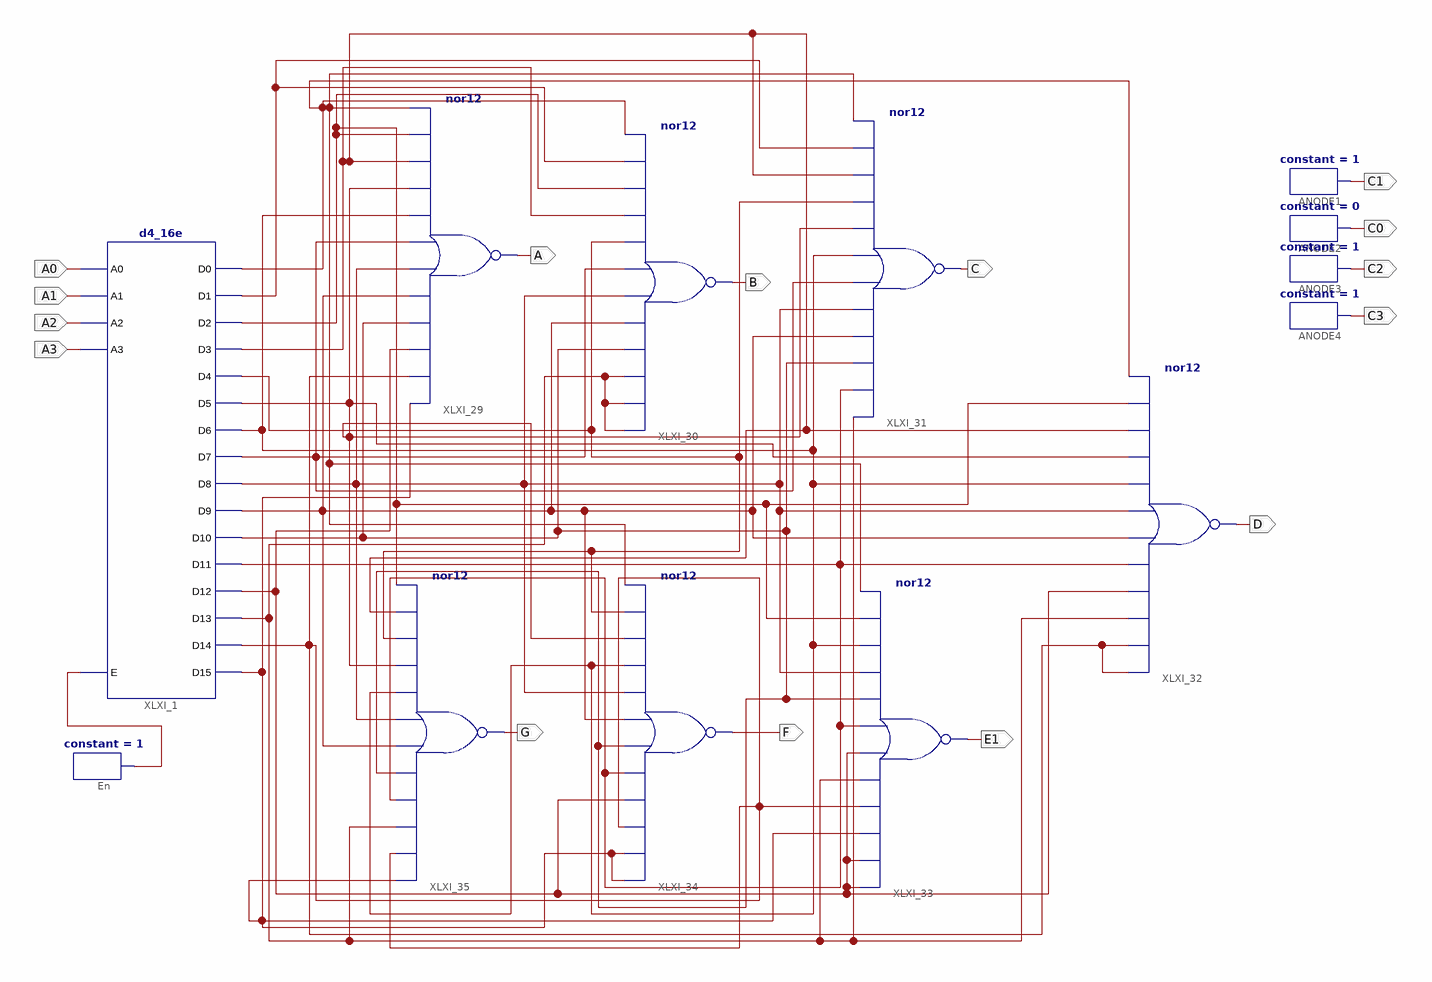
[diagram p0: schematic sheet 1]
// Xilinx ISE schematic Ass3.sch (spartan6) as structural Verilog: 13 symbols, 15 ports
module Ass3 (
  input  A0,
  input  A1,
  input  A2,
  input  A3,
  output D,
  output E1,
  output A,
  output B,
  output C,
  output F,
  output G,
  output C0,
  output C2,
  output C3,
  output C1
);

  wire XLXN_24, XLXN_26, XLXN_27, XLXN_29, XLXN_32, XLXN_33, XLXN_39, XLXN_40, XLXN_41, XLXN_46, XLXN_52,
       XLXN_56, XLXN_59, XLXN_68, XLXN_70, XLXN_71, XLXN_77;

  d4_16e XLXI_1 (
    .A0(A0), .A1(A1), .A2(A2), .A3(A3), .E(XLXN_77), .D0(XLXN_24), .D1(XLXN_26), .D10(XLXN_52),
    .D11(XLXN_56), .D12(XLXN_59), .D13(XLXN_68), .D14(XLXN_70), .D15(XLXN_71), .D2(XLXN_27), .D3(XLXN_29),
    .D4(XLXN_32), .D5(XLXN_33), .D6(XLXN_39), .D7(XLXN_40), .D8(XLXN_41), .D9(XLXN_46));
  constant #(.CValue("1")) ANODE1 (.O(C1));
  constant #(.CValue("0")) ANODE2 (.O(C0));
  constant #(.CValue("1")) ANODE3 (.O(C2));
  constant #(.CValue("1")) ANODE4 (.O(C3));
  constant #(.CValue("1")) En (.O(XLXN_77));
  nor XLXI_29 (A, XLXN_71, XLXN_70, XLXN_59, XLXN_52, XLXN_46, XLXN_41, XLXN_40, XLXN_39, XLXN_33, XLXN_29, XLXN_27, XLXN_24);
  nor XLXI_30 (B, XLXN_68, XLXN_68, XLXN_68, XLXN_52, XLXN_46, XLXN_41, XLXN_40, XLXN_32, XLXN_29, XLXN_27, XLXN_26, XLXN_24);
  nor XLXI_31 (C, XLXN_68, XLXN_56, XLXN_52, XLXN_46, XLXN_41, XLXN_40, XLXN_39, XLXN_33, XLXN_32, XLXN_29, XLXN_26, XLXN_24);
  nor XLXI_32 (D, XLXN_70, XLXN_70, XLXN_68, XLXN_59, XLXN_56, XLXN_46, XLXN_41, XLXN_39, XLXN_33, XLXN_29, XLXN_27, XLXN_24);
  nor XLXI_33 (E1, XLXN_59, XLXN_59, XLXN_71, XLXN_70, XLXN_68, XLXN_59, XLXN_56, XLXN_52, XLXN_41, XLXN_39, XLXN_27, XLXN_24);
  nor XLXI_34 (F, XLXN_71, XLXN_71, XLXN_70, XLXN_59, XLXN_56, XLXN_52, XLXN_46, XLXN_41, XLXN_39, XLXN_33, XLXN_32, XLXN_24);
  nor XLXI_35 (G, XLXN_71, XLXN_70, XLXN_68, XLXN_56, XLXN_52, XLXN_46, XLXN_41, XLXN_39, XLXN_33, XLXN_32, XLXN_29, XLXN_27);
endmodule
